# Altium project 1050a.PrjPCB
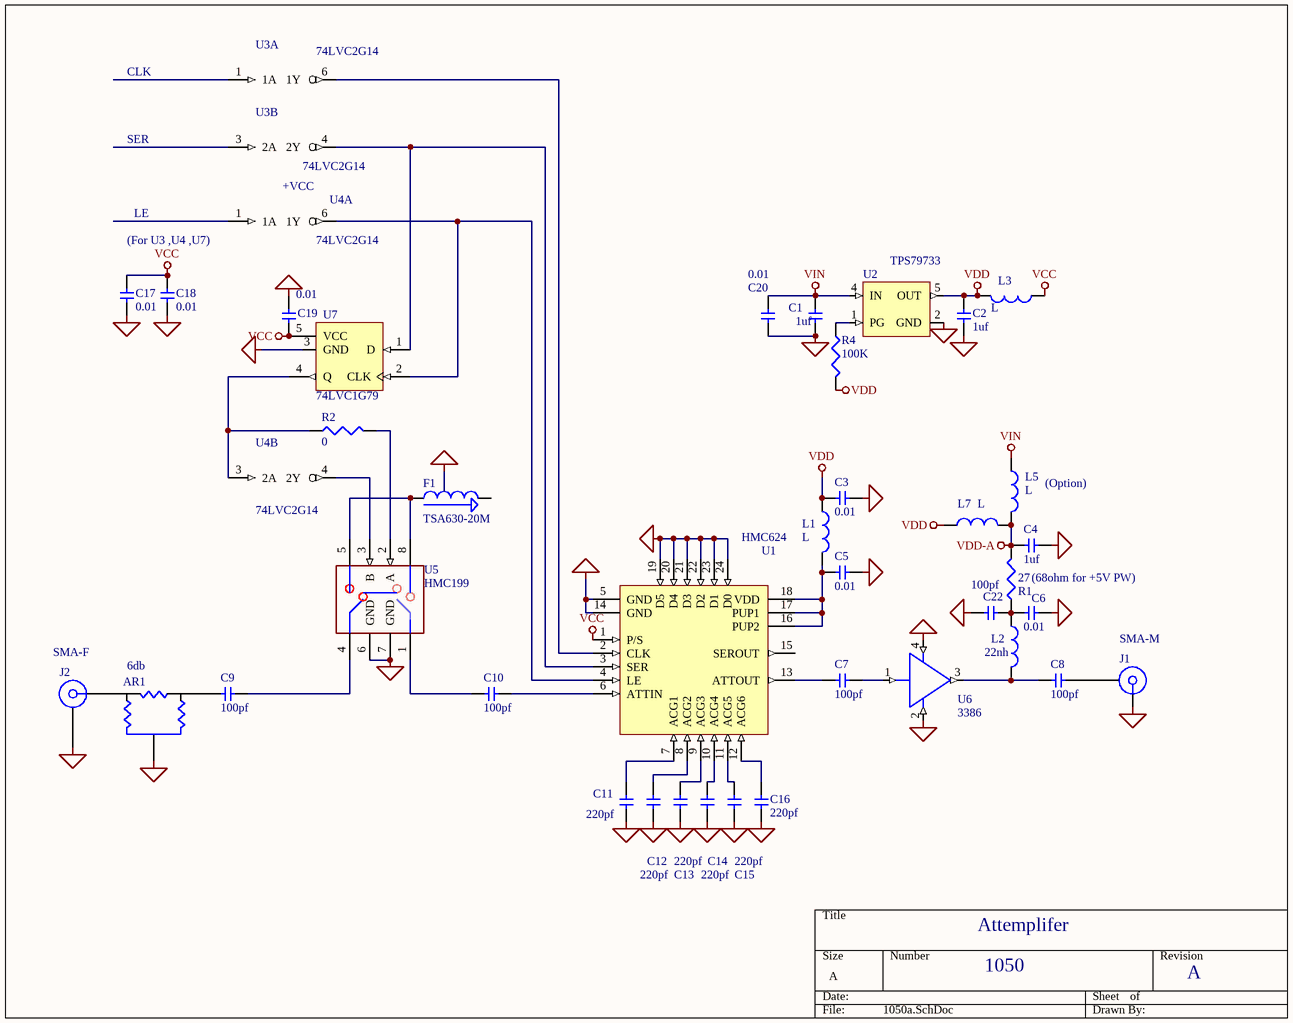
[diagram p0: 1050a.SchDoc]
1 sheet, 40 parts. Net scope: global (net labels, ports and power ports of the same name join across sheets).
Board file: 1050a.PcbDoc

## Sheet 1050a.SchDoc
size A

### Parts
AR1  6db
C1  1uf
C2  1uf
C3  0.01
C4  1uf
C5  0.01
C6  0.01
C7  100pf
C8  100pf
C9  100pf
C10  100pf
C11  220pf
C12  220pf
C13  220pf
C14  220pf
C15  220pf
C16  220pf
C17  0.01
C18  0.01
C19  0.01
C20  0.01
C22  100pf
F1  TSA630-20M
J1  SMA-M
J2  SMA-F
L1  L
L2  22nh
L3  L  [1008HS]
L5  L  [1008HS]
L7  L  [1008HS]
R1  27
R2  0
R4  100K
U1  HMC624
U2  TPS79733
U3  74LVC2G14  (parts A,B of 2)
U4  74LVC2G14  (parts A,B of 2)
U5  HMC199
U6  3386
U7  74LVC1G79

### Nets
GND: AR1.2 C1.2 C2.2 C3.2 C4.2 C5.2 C6.2 C11.2 C12.2 C13.2 C14.2 C15.2 C16.2 C17.1 C18.2 C19.2 C20.2 C22.2 J1.1 J2.2 U1.5(GND) U1.14(GND) U1.19(D5) U1.20(D4) U1.21(D3) U1.22(D2) U1.23(D1) U1.24(D0) U2.2(GND) U3.2(GND) U4.2(GND) U5.6(GND) U5.7(GND) U6.2 U6.4 U7.3(GND)
VCC: C17.2 C18.1 C19.1 L3.1 U1.1(P/S) U3.5(VCC) U4.5(VCC) U7.5(VCC)
VDD: C2.1 C3.1 L1.1 L3.2 L7.1 R4.2 U2.5(OUT)
VDD-A: C4.1 L5.2 L7.2 R1.2
VIN: C1.1 C20.1 L5.1 U2.4(IN)
NetAR1_1: AR1.1 J2.1
NetAR1_3: AR1.3 C9.1
NetC5_1: C5.1 L1.2 U1.16(PUP2) U1.17(PUP1) U1.18(VDD)
NetC6_1: C6.1 C22.1 L2.1 R1.1
NetC7_1: C7.1 U1.13(ATTOUT)
NetC7_2: C7.2 U6.1(IN)
NetC8_1: C8.1 L2.2 U6.3(OUT])
NetC8_2: C8.2 J1.2
NetC9_2: C9.2 U5.4(RFC2)
NetC10_1: C10.1 U5.1(RFC1)
NetC10_2: C10.2 U1.6(ATTIN)
NetC11_1: C11.1 U1.7(ACG1)
NetC12_1: C12.1 U1.8(ACG2)
NetC13_1: C13.1 U1.9(ACG3)
NetC14_1: C14.1 U1.10(ACG4)
NetC15_1: C15.1 U1.11(ACG5)
NetC16_1: C16.1 U1.12(ACG6)
NetF1_2: F1.2 U5.5(RF2) U5.8(RF1)
NetR2_1: R2.1 U4.3(2A) U7.4(Q)
NetR2_2: R2.2 U5.2(A)
NetR4_1: R4.1 U2.1(PG)
NetU1_2: U1.2(CLK) U3.6(1Y)
NetU1_3: U1.3(SER) U3.4(2Y) U7.1(D)
NetU1_4: U1.4(LE) U4.6(1Y) U7.2(CLK)
NetU4_4: U4.4(2Y) U5.3(B)

Not connected (* = marked no-connect by the designer): F1 1; U1 15(SEROUT); U3 1(1A) 3(2A); U4 1(1A)

### Notes on the sheet
- CLK
- SER
- LE
- +VCC
- (For U3 ,U4 ,U7)
- (Option)
- (68ohm for +5V PW)
- Attemplifer
- 1050
- A

### Library data of the parts
AR1 = ATTN
C1-C20 C22 = C
F1 = INDUCTOR VAR
J1 J2 = BNC
L1-L3 L5 L7 = L: Chip Inductors; Text Field1: Coil Craft
R1 R2 R4 = R
U6 = MAR-4